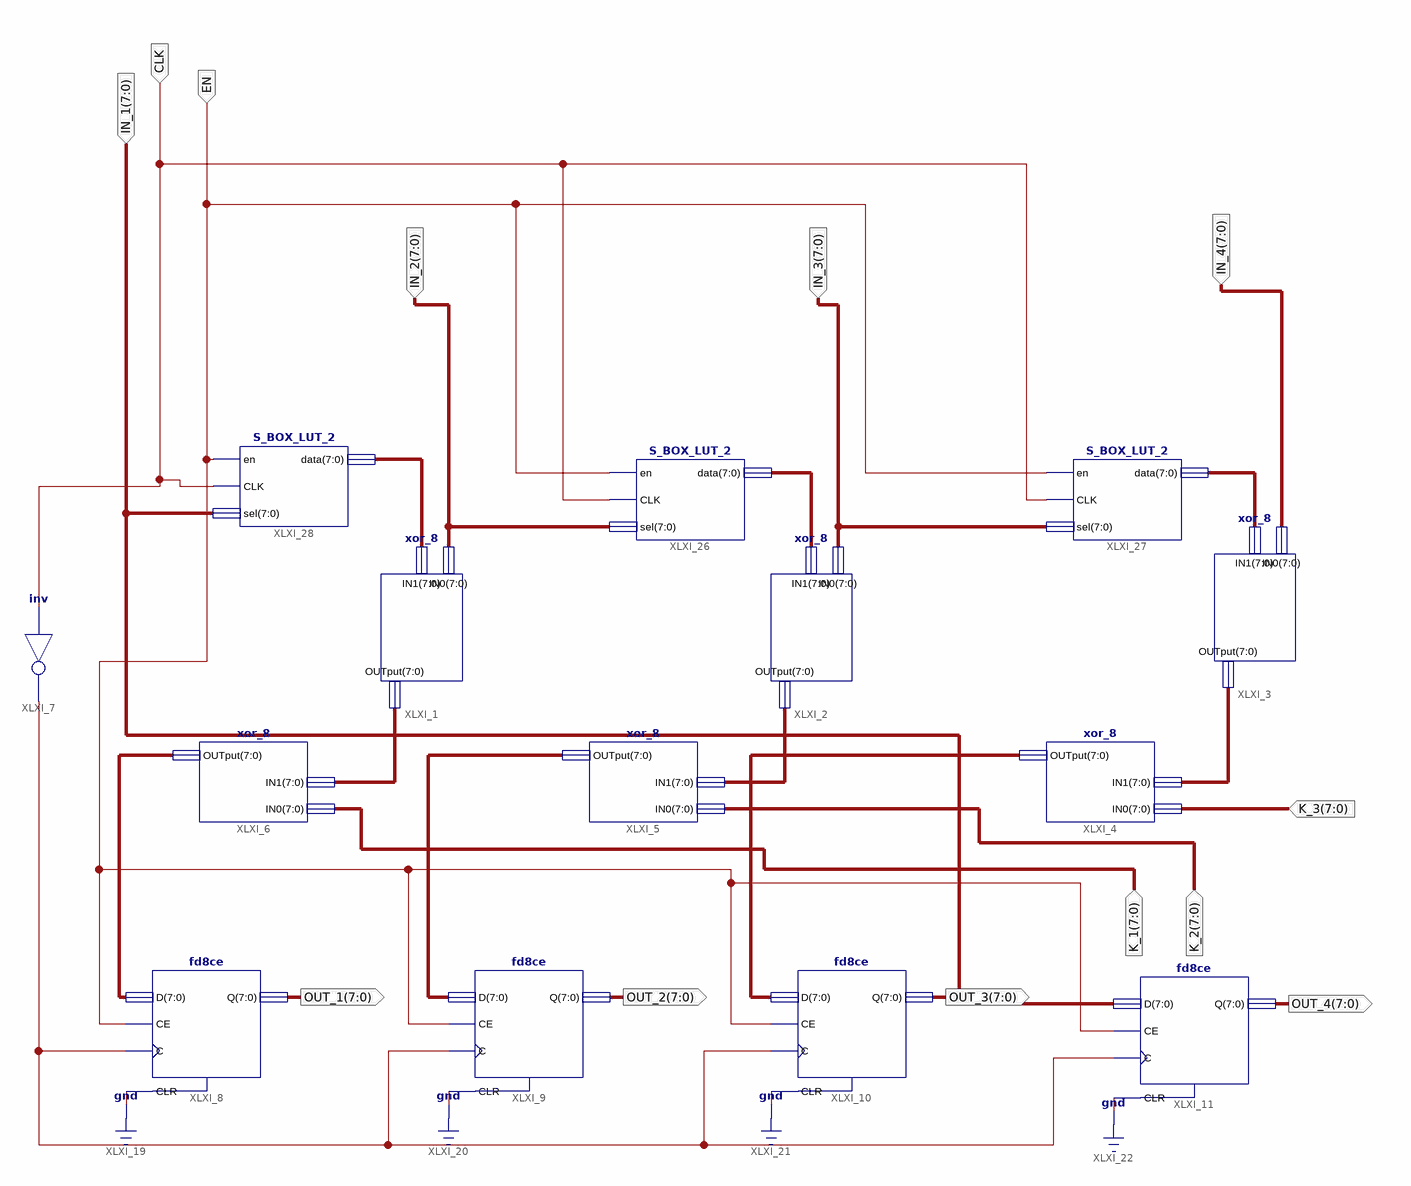
[diagram p0: schematic sheet 1]
// Xilinx ISE schematic Main_2.sch (spartan6) as structural Verilog: 14 symbols, 13 ports
module Main_2 (
  input  [7:0] IN_3,
  input  [7:0] IN_4,
  input  [7:0] IN_2,
  input  [7:0] IN_1,
  input  [7:0] K_2,
  input  [7:0] K_1,
  input  [7:0] K_3,
  input  CLK,
  input  EN,
  output [7:0] OUT_1,
  output [7:0] OUT_2,
  output [7:0] OUT_3,
  output [7:0] OUT_4
);

  wire XLXN_12;
  wire [7:0] XLXN_3, XLXN_4, XLXN_5, XLXN_6, XLXN_7, XLXN_8, XLXN_39, XLXN_40, XLXN_41;

  xor_8 XLXI_1 (.IN0(IN_2), .IN1(XLXN_3), .OUTput(XLXN_8));
  xor_8 XLXI_2 (.IN0(IN_3), .IN1(XLXN_4), .OUTput(XLXN_7));
  xor_8 XLXI_3 (.IN0(IN_4), .IN1(XLXN_5), .OUTput(XLXN_6));
  xor_8 XLXI_4 (.IN0(K_3), .IN1(XLXN_6), .OUTput(XLXN_41));
  xor_8 XLXI_5 (.IN0(K_2), .IN1(XLXN_7), .OUTput(XLXN_40));
  xor_8 XLXI_6 (.IN0(K_1), .IN1(XLXN_8), .OUTput(XLXN_39));
  not XLXI_7 (XLXN_12, CLK);
  fd8ce XLXI_8 (.C(XLXN_12), .CE(EN), .CLR(1'b0), .D(XLXN_39), .Q(OUT_1));
  fd8ce XLXI_9 (.C(XLXN_12), .CE(EN), .CLR(1'b0), .D(XLXN_40), .Q(OUT_2));
  fd8ce XLXI_10 (.C(XLXN_12), .CE(EN), .CLR(1'b0), .D(XLXN_41), .Q(OUT_3));
  fd8ce XLXI_11 (.C(XLXN_12), .CE(EN), .CLR(1'b0), .D(IN_1), .Q(OUT_4));
  S_BOX_LUT_2 XLXI_26 (.en(EN), .CLK(CLK), .sel(IN_2), .data(XLXN_4));
  S_BOX_LUT_2 XLXI_27 (.en(EN), .CLK(CLK), .sel(IN_3), .data(XLXN_5));
  S_BOX_LUT_2 XLXI_28 (.en(EN), .CLK(CLK), .sel(IN_1), .data(XLXN_3));
endmodule
